# EAGLE design 16_key_i2c_pad_draft1 (EAGLE 9.2.2)
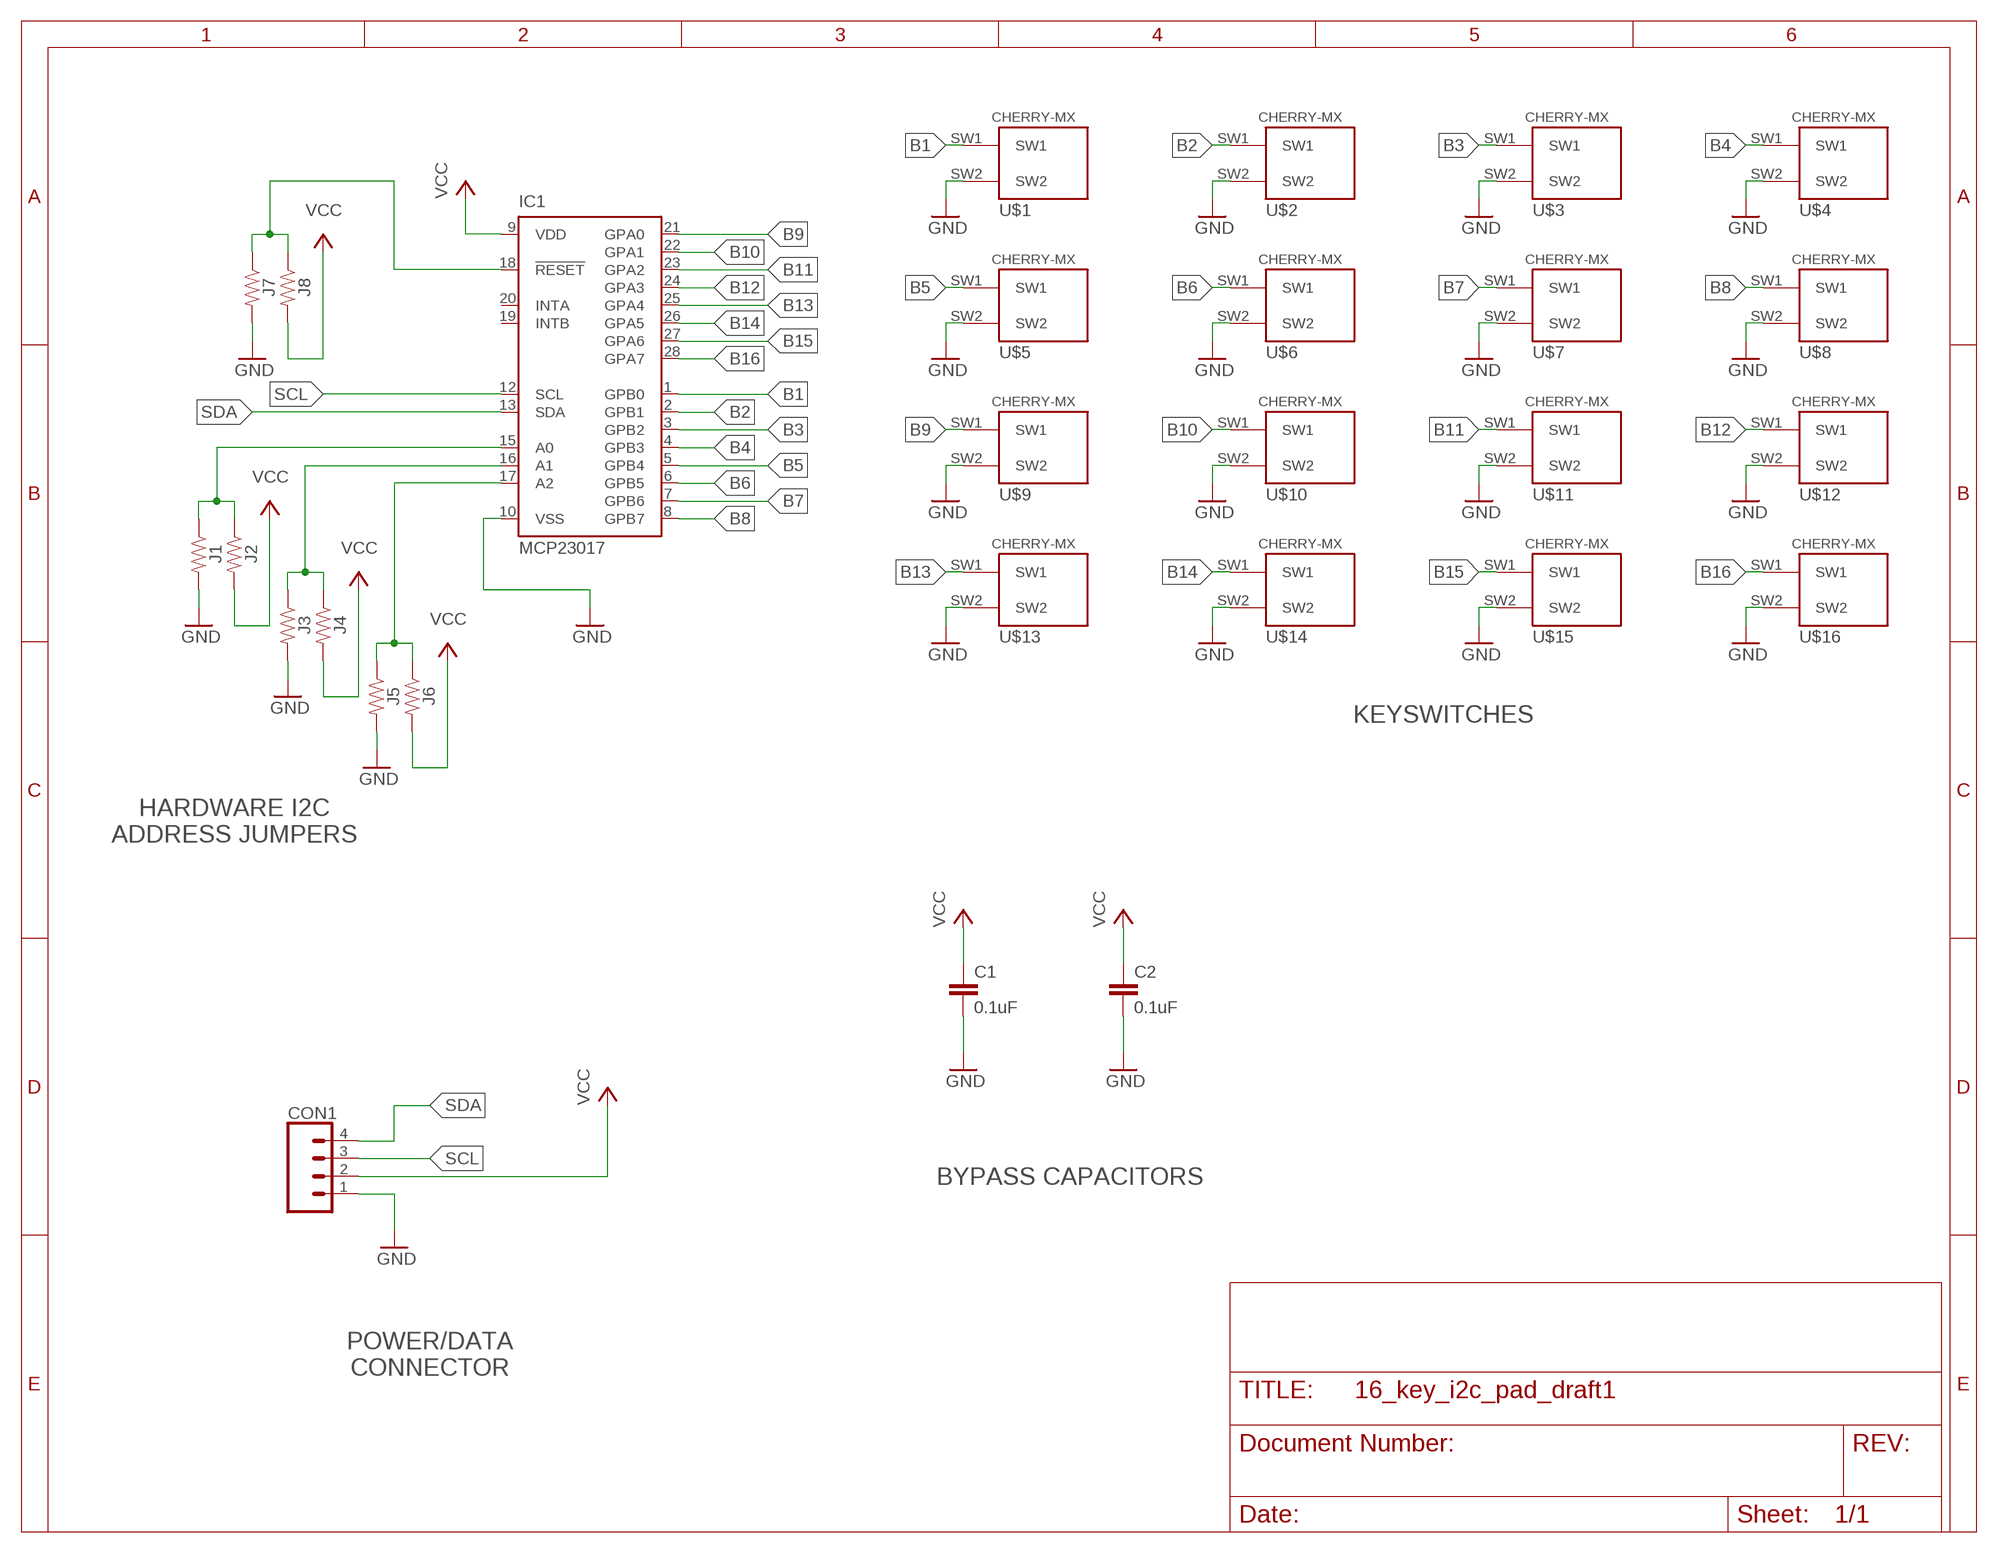
[diagram p0: schematic, sheet 1]

## Parts
C1  0.1uF  0.1UF-KIT-EZ-50V-20%  [CAP-PTH-SMALL-KIT]
C2  0.1uF  0.1UF-KIT-EZ-50V-20%  [CAP-PTH-SMALL-KIT]
CON1  CONN_04  [1X04]
IC1  MCP23017  MCP23017SP  [DIL28-3]
J1  RESISTOR0805  [0805]
J2  RESISTOR0805  [0805]
J3  RESISTOR0805  [0805]
J4  RESISTOR0805  [0805]
J5  RESISTOR0805  [0805]
J6  RESISTOR0805  [0805]
J7  RESISTOR0805  [0805]
J8  RESISTOR0805  [0805]
U$1  CHERRY-MXSTANDARD  [CHERRY-MX]
U$2  CHERRY-MXSTANDARD  [CHERRY-MX]
U$3  CHERRY-MXSTANDARD  [CHERRY-MX]
U$4  CHERRY-MXSTANDARD  [CHERRY-MX]
U$5  CHERRY-MXSTANDARD  [CHERRY-MX]
U$6  CHERRY-MXSTANDARD  [CHERRY-MX]
U$7  CHERRY-MXSTANDARD  [CHERRY-MX]
U$8  CHERRY-MXSTANDARD  [CHERRY-MX]
U$9  CHERRY-MXSTANDARD  [CHERRY-MX]
U$10  CHERRY-MXSTANDARD  [CHERRY-MX]
U$11  CHERRY-MXSTANDARD  [CHERRY-MX]
U$12  CHERRY-MXSTANDARD  [CHERRY-MX]
U$13  CHERRY-MXSTANDARD  [CHERRY-MX]
U$14  CHERRY-MXSTANDARD  [CHERRY-MX]
U$15  CHERRY-MXSTANDARD  [CHERRY-MX]
U$16  CHERRY-MXSTANDARD  [CHERRY-MX]

## Nets
B1: IC1.1(GPB0) U$1.SW1
B2: IC1.2(GPB1) U$2.SW1
B3: IC1.3(GPB2) U$3.SW1
B4: IC1.4(GPB3) U$4.SW1
B5: IC1.5(GPB4) U$5.SW1
B6: IC1.6(GPB5) U$6.SW1
B7: IC1.7(GPB6) U$7.SW1
B8: IC1.8(GPB7) U$8.SW1
B9: IC1.21(GPA0) U$9.SW1
B10: IC1.22(GPA1) U$10.SW1
B11: IC1.23(GPA2) U$11.SW1
B12: IC1.24(GPA3) U$12.SW1
B13: IC1.25(GPA4) U$13.SW1
B14: IC1.26(GPA5) U$14.SW1
B15: IC1.27(GPA6) U$15.SW1
B16: IC1.28(GPA7) U$16.SW1
GND: C1.2 C2.2 CON1.1 IC1.10(VSS) J1.2 J3.2 J5.2 J7.2 U$1.SW2 U$2.SW2 U$3.SW2 U$4.SW2 U$5.SW2 U$6.SW2 U$7.SW2 U$8.SW2 U$9.SW2 U$10.SW2 U$11.SW2 U$12.SW2 U$13.SW2 U$14.SW2 U$15.SW2 U$16.SW2
N$2: IC1.15(A0) J1.1 J2.1
N$3: IC1.16(A1) J3.1 J4.1
N$4: IC1.17(A2) J5.1 J6.1
N$5: IC1.18(!RESET) J7.1 J8.1
SCL: CON1.3 IC1.12(SCL)
SDA: CON1.4 IC1.13(SDA)
VCC: C1.1 C2.1 CON1.2 IC1.9(VDD) J2.2 J4.2 J6.2 J8.2
Unconnected: IC1.19(INTB) IC1.20(INTA)

## Notes on the sheet
- KEYSWITCHES
- HARDWARE I2C
  ADDRESS JUMPERS
- BYPASS CAPACITORS
- POWER/DATA
  CONNECTOR

## Library data of the parts
C1 C2 = SparkFun-Capacitors:0.1UF: 0.1µF ceramic capacitors A capacitor is a passive two-terminal electrical component used to store electrical energy temporarily in an electric field.; PROD_ID: CAP-08370
CON1 = SparkFun-Connectors:CONN_04: Multi connection point. Often used as Generic Header-pin footprint for 0.1 inch spaced/style header connections On any of the 0.1 inch spaced packages, you can populate with these: Break Away Headers - Straight <https://www.sparkfun.com/products/116> (PRT-00116) Break Away Male Headers - Right Angle <https://www.sparkfun.com/products/553> (PRT-00553) Female Headers <https://www.sparkfun.com/products/115> (PRT-00115) Break Away Headers - Machine Pin <https://www.sparkfun.com/products/117> (PRT-00117) Break Away Female Headers - Swiss Machine Pin <https://www.sparkfun.com/products/743> (PRT-00743) For SCREWTERMINALS and SPRING TERMINALS visit here: Screw Terimnals on SparkFun.com <https://www.sparkfun.com/search/results?term=Screw+Terminals> (5mm/3.5mm/2.54mm spacing) This device is also useful as a general connection point to wire up your design to another part of your project. Our various solder wires solder well into these plated through hole pads. Hook-Up Wire - Assortment (Stranded, 22 AWG) <https://www.sparkfun.com/products/11375> (PRT-11375) Hook-Up Wire - Assortment (Solid Core, 22 AWG) <https://www.sparkfun.com/products/11367> (PRT-11367) View the entire wire category on our website here <https://www.sparkfun.com/categories/141> Special notes: Molex polarized connector foot print use with SKU : PRT-08231 with associated crimp pins and housings. 1MM SMD Version SKU: PRT-10208; PROD_ID: CONN-09696
IC1 = microchip:MCP23017: http://ww1.microchip.com/downloads/en/DeviceDoc/21952a.pdf Source: http://ww1.microchip.com/downloads/en/DeviceDoc/21952a.pdf; MF: MICROCHIP; MPN: MCP23017-E/SP; OC_FARNELL: 1332088; OC_NEWARK: 31K2959
J1-J8 = SparkFun-Resistors:RESISTOR: Generic Resistor Package
U$1-U$16 = cherrymx:CHERRY-MX: Cherry MX series keyswitch

## Board
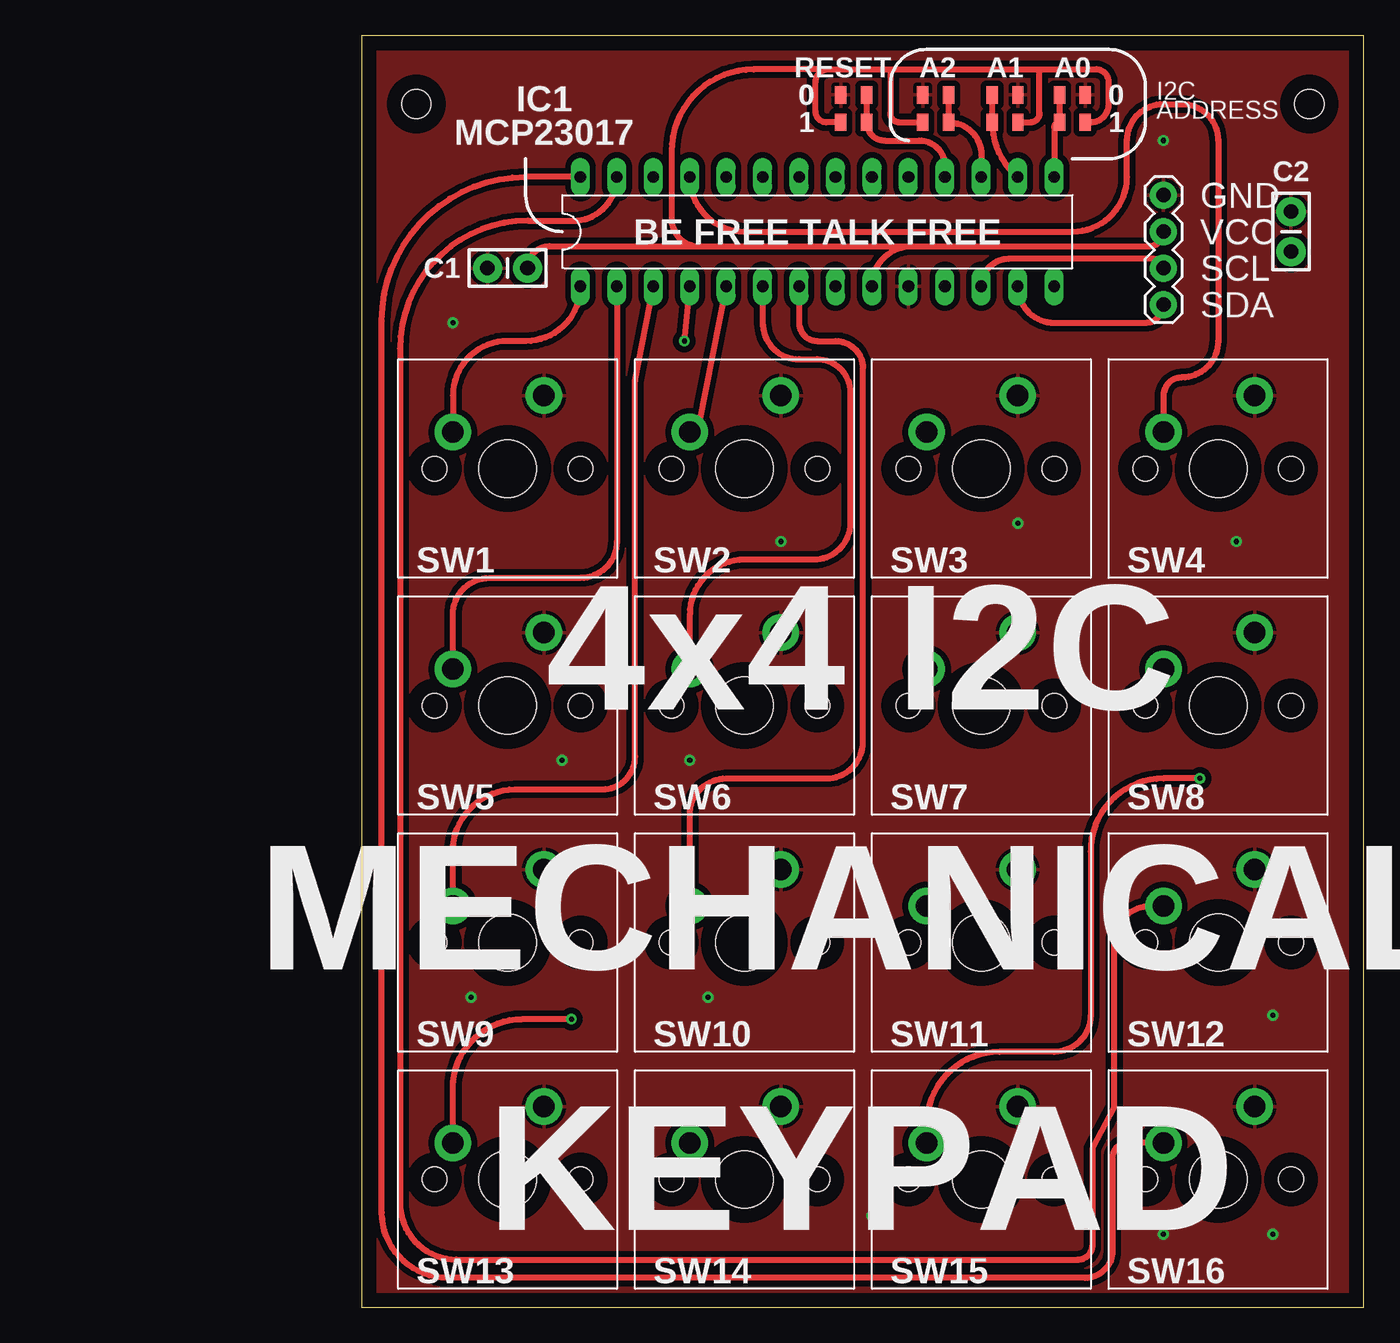
[diagram p1: board, top side]
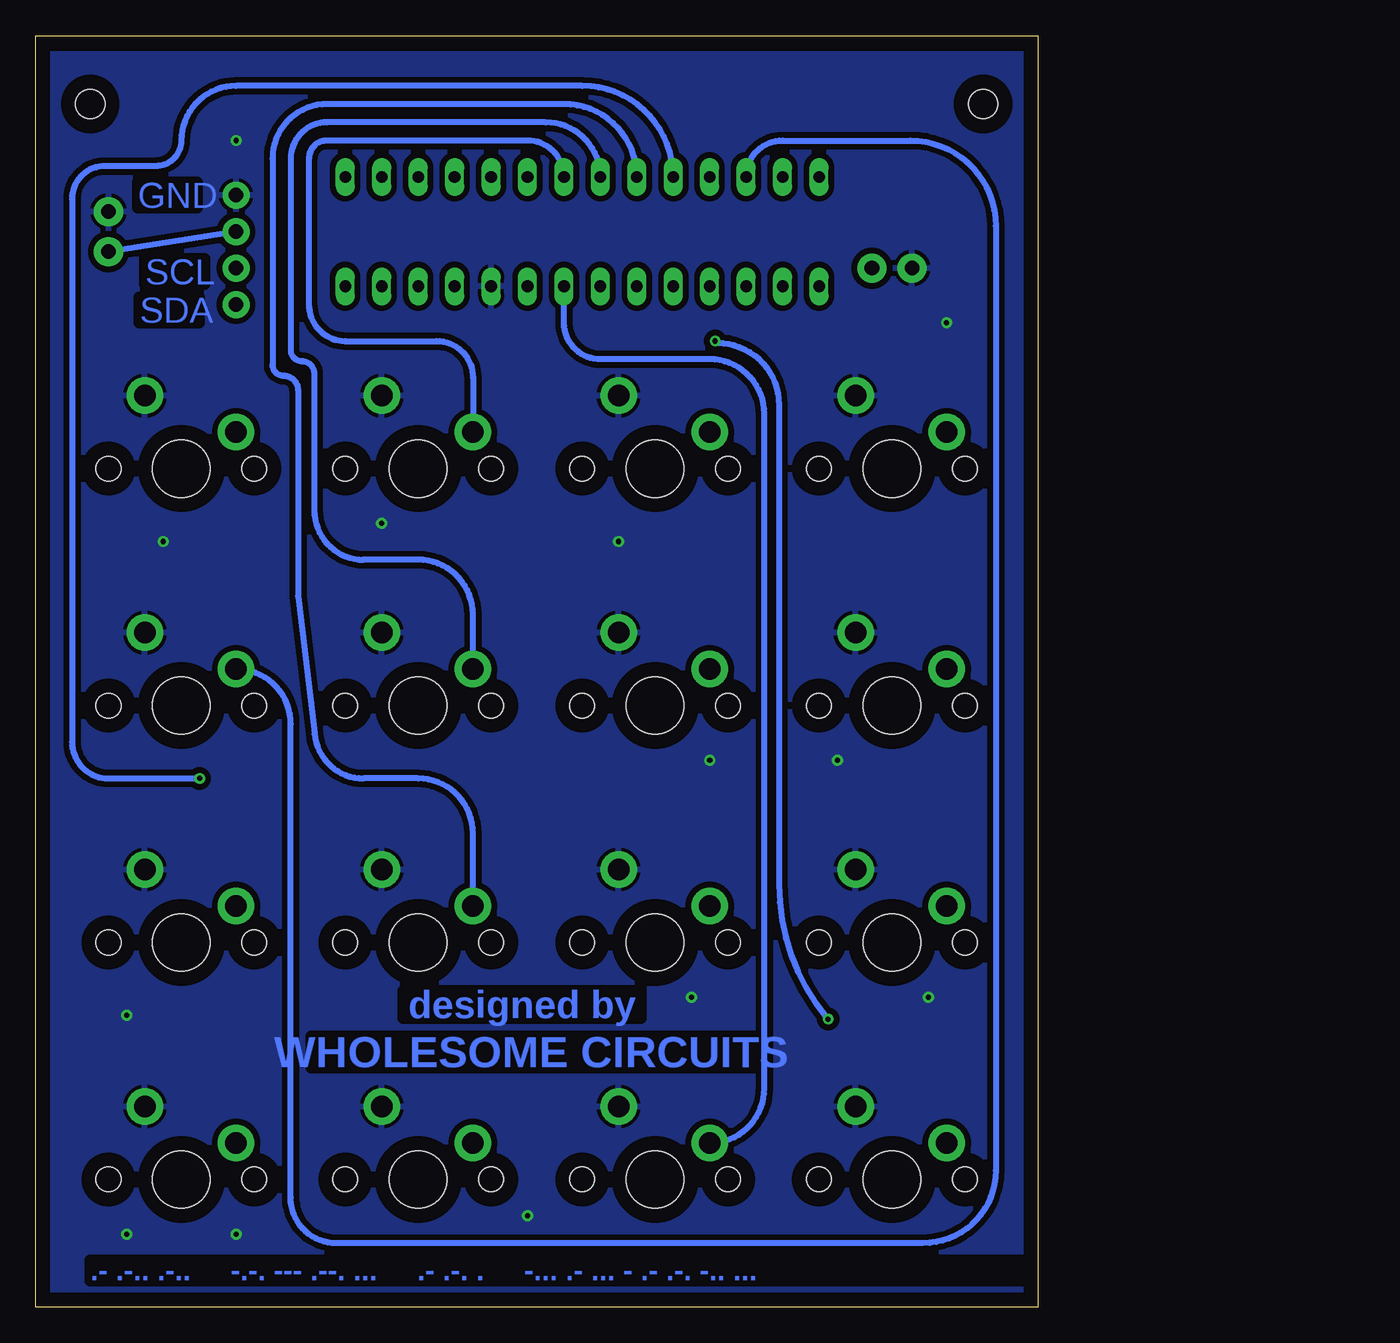
[diagram p2: board, bottom side, seen from below]

Size 69.83 x 88.57 mm. Coordinates in mm from the lower left corner, seen from the top.
Outline: 0,0 69.83,0 69.83,88.57 0,88.57 0,0
Copper layers (1*16): Top 0.035mm / dielectric 1.5mm / Bottom 0.035mm
Design rules "default": minimum track width 6mil, minimum drill 0.35mm, track to track 6mil, track to pad 6mil, pad to pad 6mil, via to via 6mil, smd to smd 6mil, copper to edge 40mil, drill to drill 6mil, minimum pad ring 10mil, minimum via ring 8mil, stop-mask expansion 4mil, vias tented up to drill 0mil, thermal gap 10mil
Holes 2.03 mm at 3.81,83.82 66.04,83.82

### Footprints (pad centres in the part's own frame; a part is rotated, then mirrored left to right if it is on the bottom)
CAP-PTH-SMALL-KIT = drill 1.016 pad 2.032: 1 -1.397,0; 2 1.397,0
1X04 = drill 1.016 pad 1.88: 1 0,0; 2 2.54,0; 3 5.08,0; 4 7.62,0
DIL28-3 = drill 0.813 long: 1 -16.51,-3.81; 2 -13.97,-3.81; 3 -11.43,-3.81; 4 -8.89,-3.81; 5 -6.35,-3.81; 6 -3.81,-3.81; 7 -1.27,-3.81; 8 1.27,-3.81; 9 3.81,-3.81; 10 6.35,-3.81; 11 8.89,-3.81; 12 11.43,-3.81; 13 13.97,-3.81; 14 16.51,-3.81; 15 16.51,3.81; 16 13.97,3.81; 17 11.43,3.81; 18 8.89,3.81; 19 6.35,3.81; 20 3.81,3.81; 21 1.27,3.81; 22 -1.27,3.81; 23 -3.81,3.81; 24 -6.35,3.81; 25 -8.89,3.81; 26 -11.43,3.81; 27 -13.97,3.81; 28 -16.51,3.81
0805 = smd 0.8 x 1.2: 1 -0.9,0; 2 0.9,0
CHERRY-MX = drill 1.5 pad 2.54: SW1 -3.81,2.54; SW2 2.54,5.08 | hole 4: 0,0 | hole 1.714: 5.08,0; -5.08,0

### Placement (x,y rotation side)
C1  10.16,72.39 180 top
C2  64.77,74.93 90 top
CON1  55.88,77.47 270 top
IC1  31.75,74.93 0 top
J1  49.53,84.45 0 top
J2  49.53,82.55 0 top
J3  44.83,84.45 0 top
J4  44.83,82.55 0 top
J5  40.01,84.45 180 top
J6  40.01,82.55 180 top
J7  34.29,84.45 180 top
J8  34.29,82.55 180 top
U$1  10.16,58.42 0 top
U$2  10.16,41.91 0 top
U$3  10.16,25.4 0 top
U$4  10.16,8.89 0 top
U$5  26.67,58.42 0 top
U$6  26.67,41.91 0 top
U$7  26.67,25.4 0 top
U$8  26.67,8.89 0 top
U$9  43.18,58.42 0 top
U$10  43.18,41.91 0 top
U$11  43.18,25.4 0 top
U$12  43.18,8.89 0 top
U$13  59.69,58.42 0 top
U$14  59.69,41.91 0 top
U$15  59.69,25.4 0 top
U$16  59.69,8.89 0 top

### Tracks (layer width: path | path; a pad name or v marks a point on that pad's centre or on a via)
B1
  Top 0.406: IC1.1 arc-90 11.43,67.31 10.16,67.31 arc90 6.35,63.5 U$1.SW1
B2
  Top 0.406: U$2.SW1 6.35,48.26 arc-90 8.89,50.8 15.24,50.8 arc90 17.78,53.34 IC1.2
B3
  Top 0.406: U$3.SW1 6.35,31.75 arc-90 10.67,36.07 16.76,36.07 arc90 19.05,38.35 19.05,64.52 IC1.3
B4  (via drill 0.35)
  Top 0.406: U$4.SW1 6.35,15.24 arc-90 11.18,20.07 v14.61,20.07 | v22.48,67.31 IC1.4
  Bottom 0.406: v22.48,67.31 arc90 22.35,67.18 arc90 18.03,62.87 18.03,29.44 arc-39 14.73,20.19 arc-11 v14.61,20.07
B5
  Top 0.406: IC1.5 23.5,61.59 arc-67 U$5.SW1
B6
  Top 0.406: U$6.SW1 22.86,48.26 arc-90 26.67,52.07 31.5,52.07 arc90 34.04,54.61 34.04,63.75 arc90 31.75,66.04 30.48,66.04 arc-90 27.94,68.58 IC1.6
B7
  Top 0.406: U$7.SW1 22.86,34.29 arc-90 25.4,36.83 32.38,36.83 arc90 34.92,39.37 34.92,65.41 arc90 33.02,67.31 31.75,67.31 arc-90 30.48,68.58 IC1.7
B8
  Bottom 0.406: U$8.SW1 arc-90 19.05,15.24 19.05,62.23 arc-90 22.86,66.04 30.48,66.04 arc90 33.02,68.58 IC1.8
B9
  Bottom 0.406: IC1.21 arc-90 35.56,81.28 49.53,81.28 arc-90 50.8,80.01 50.8,69.85 arc-90 48.26,67.31 41.91,67.31 arc90 39.37,64.77 U$9.SW1
B10
  Bottom 0.406: IC1.22 arc-90 34.29,82.55 49.53,82.55 arc-90 52.07,80.01 52.07,66.67 arc-90 51.31,65.91 arc90 50.42,65.02 50.42,55.5 arc-90 46.99,52.07 43.18,52.07 arc90 39.37,48.26 U$10.SW1
B11
  Bottom 0.406: IC1.23 arc-90 33.02,83.82 49.53,83.82 arc-90 53.34,80.01 53.34,65.66 arc-90 52.58,64.9 arc90 51.56,63.88 51.56,49.53 50.42,40.26 arc-90 46.99,36.83 43.18,36.83 arc90 39.37,33.02 U$11.SW1
B12  (via drill 0.35)
  Top 0.406: v58.42,36.83 55.88,36.83 arc90 50.8,31.75 50.8,20.32 arc-90 48.26,17.78 44.45,17.78 arc90 39.37,12.7 U$12.SW1
  Bottom 0.406: IC1.24 arc-90 31.75,85.09 55.88,85.09 arc-90 59.69,81.28 arc90 61.47,79.5 65.02,79.5 arc-90 67.31,77.22 67.31,39.37 arc-90 64.77,36.83 v58.42,36.83
B13
  Top 0.406: IC1.25 arc90 26.67,74.93 49.53,74.93 arc90 53.34,78.74 53.34,81.28 arc-90 55.88,83.82 57.15,83.82 arc-90 59.69,81.28 59.69,67.31 arc-90 57.15,64.77 arc90 55.88,63.5 U$13.SW1
B14
  Bottom 0.406: IC1.26 arc90 17.78,81.28 8.89,81.28 arc90 2.92,75.31 2.92,9.53 arc90 8,4.45 48.9,4.45 arc90 52.07,7.62 52.07,40.64 arc-90 U$14.SW1
B15
  Top 0.406: U$15.SW1 54.99,27.94 arc90 52.45,25.4 52.45,13.97 50.93,11.05 50.93,4.32 arc-90 49.91,3.3 6.6,3.3 arc-90 2.67,7.24 2.67,66.8 arc-90 11.56,75.69 14.73,75.69 arc90 IC1.27
B16
  Top 0.406: IC1.28 11.43,78.74 arc90 1.4,68.71 1.4,6.6 arc90 5.97,2.03 50.42,2.03 arc90 52.32,3.94 52.32,10.41 arc-90 53.34,11.43 U$16.SW1
GND  (via drill 0.35)
  other vias: 55.88,81.28 6.35,68.58 13.97,38.1 22.86,38.1 7.62,21.59 24.13,21.59 63.5,20.32 60.96,53.34 29.21,53.34 55.88,5.08 35.56,6.35 63.5,5.08 45.72,54.61
  pour Top (isolate 0.406): 0,0 69.85,0 69.85,87.63 0,87.63
  pour Bottom (isolate 0.406): 0,87.63 69.85,87.63 69.85,0 0,0
N$2
  Top 0.406: J1.1 J2.1 arc90 48.26,82.18 IC1.15
N$3
  Top 0.406: J3.1 J4.1 arc50 IC1.16
N$4
  Top 0.406: J5.1 J6.1 arc-90 43.18,80.28 IC1.17
N$5
  Top 0.406: J7.1 J8.1 arc90 36.46,81.28 38.86,81.28 arc-90 40.64,79.5 IC1.18
SCL
  Top 0.406: CON1.3 arc90 55.24,73.03 45.09,73.03 arc90 IC1.12
SDA
  Top 0.406: IC1.13 arc90 48.26,68.58 54.61,68.58 arc90 CON1.4
VCC
  Top 0.406: IC1.9 arc-90 38.35,73.91 | CON1.2 arc-90 54.86,73.91 38.35,73.91 | 47.24,86.23 51.18,86.23 arc-90 52.07,85.34 52.07,83.82 arc-90 50.8,82.55 J2.2 | J4.2 46.61,82.55 arc90 47.24,83.19 47.24,86.23 | C1.1 arc-90 13.08,73.91 23.5,73.91 | 23.5,73.91 38.35,73.91 | J8.2 32.38,82.55 arc-90 31.62,83.31 31.62,85.34 arc-90 32.51,86.23 | 32.51,86.23 36.83,86.23 | 36.83,86.23 47.24,86.23 | 36.83,86.23 36.83,83.19 arc90 37.47,82.55 J6.2 | 32.51,86.23 27.3,86.23 arc90 21.59,80.52 21.59,75.82 arc90 23.5,73.91
  Bottom 0.406: CON1.2 C2.1

### Text on the board
Bottom: GND | SCL | SDA | designed by | WHOLESOME CIRCUITS | .- .-.. .-.. -.-. --- .--. ... .- .-. . -... .- ... - .- .-. -.. ...
tPlace: RESET | A2 | A1 | A0 | 0 | 0 | 0 | I2C / ADDRESS | 1 | 1 | C2 | GND | BE FREE TALK FREE | VCC | C1 | SCL | SDA | SW1 | SW2 | SW3 | SW4 | SW5 | SW6 | SW7 | SW8 | 4x4 I2C / / MECHANICAL / / KEYPAD | SW9 | SW10 | SW11 | SW12 | SW13 | SW14 | SW15 | SW16
bStop: GND | SCL | SDA | designed by | WHOLESOME CIRCUITS | .- .-.. .-.. -.-. --- .--. ... .- .-. . -... .- ... - .- .-. -.. ...